# Altium schematic sheet Power Switch.SchDoc: Main Power Switch
size A4
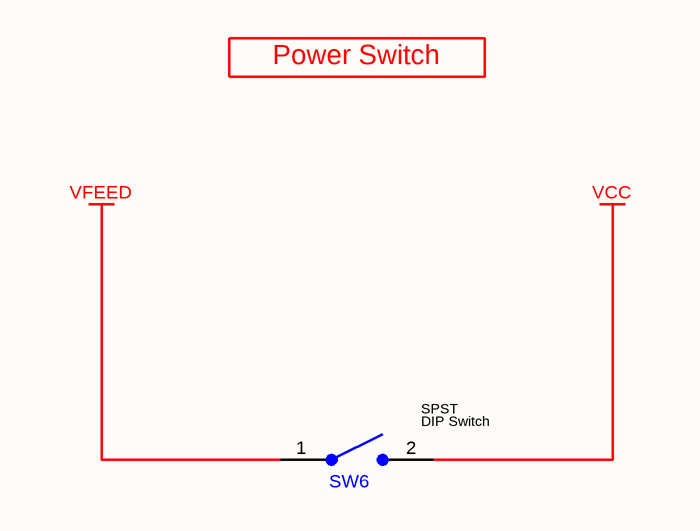
[diagram p0: Power Switch.SchDoc]

## Parts
SW6  DIP Switch  [DS04-254-2-01BK-SMT-TR]  (value not drawn)

## Nets
VCC: SW6.2(NO)
VFEED: SW6.1(COM)

## Notes on the sheet
- Power Switch
- Title
- Size:
- Date:
- A4
- Number:
- Time:
- Revision:
- Sheet
- of
- File:
- (in symbol Switch - DIP Switch (1 Pole)) SPST

## Library data of the parts
SW6 = Switch - DIP Switch (1 Pole): DIP Switches/SIP Switches DIP Switch, SPST, 2.54 pitch, flat actuator, SMT, Tape and reel, 1 position, Black; Manufacturer Name: CUI Devices; Manufacturer Part Number: DS04-254-2-01BK-SMT-TR; Mouser Part Number: 490-DS04254201BK-STR; ComponentLink1Description: DataSheet; ComponentLink1URL: https://www.mouser.com.tr/datasheet/2/670/ds04_254_smt-1777718.pdf; ComponentLink2Description: Mouser; ComponentLink2URL: https://www.mouser.com.tr/ProductDetail/CUI-Devices/DS04-254-2-01BK-SMT-TR/?qs=%2Fha2pyFadujy0kBXqTx%252B7K4ZqypoI1xcyUu3ptD5LL%252BAwZdjUHFG%252BXP1ryAUxmHU; Supplier 1: RSComponents; Supplier 2: Arrow Electronics; Supplier 3: Farnell; Supplier 4: Newark; Supplier 5: Digi-Key; Supplier Part Number 1: 6820986; Supplier Part Number 2: A6S-1104-H; Supplier Part Number 3: 1960892; Supplier Part Number 4: 83T2298; Supplier Part Number 5: Z5187-ND